# Altium schematic sheet LionIRVT-HW.SchDoc
size A4
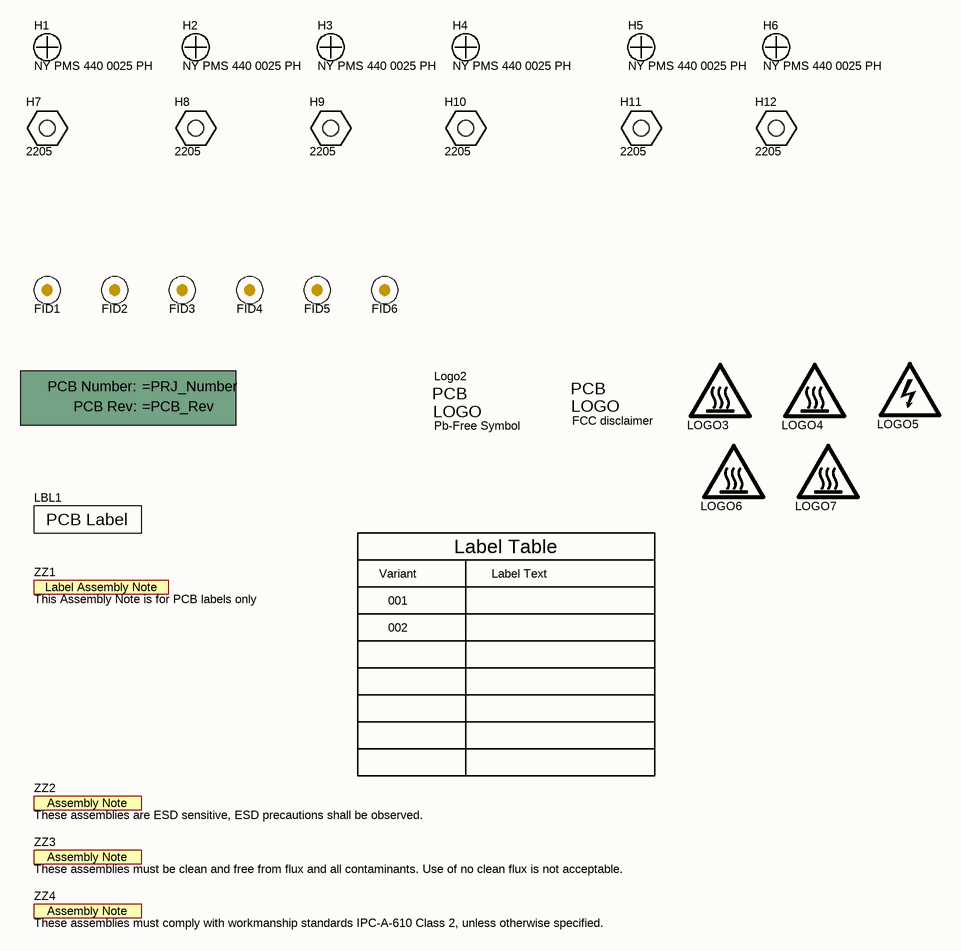
[diagram p0: LionIRVT-HW.SchDoc]

## Parts
!PCB1  Printed Circuit Board  (value not drawn)  (mechanical)
FID1  Fiducial  [Fiducial10-20]  (value not drawn)
FID2  Fiducial  [Fiducial10-20]  (value not drawn)
FID3  Fiducial  [Fiducial10-20]  (value not drawn)
FID4  Fiducial  [Fiducial10-20]  (value not drawn)
FID5  Fiducial  [Fiducial10-20]  (value not drawn)
FID6  Fiducial  [Fiducial10-20]  (value not drawn)
H1  NY PMS 440 0025 PH  [NY PMS 440 0025 PH]
H2  NY PMS 440 0025 PH  [NY PMS 440 0025 PH]
H3  NY PMS 440 0025 PH  [NY PMS 440 0025 PH]
H4  NY PMS 440 0025 PH  [NY PMS 440 0025 PH]
H5  NY PMS 440 0025 PH  [NY PMS 440 0025 PH]
H6  NY PMS 440 0025 PH  [NY PMS 440 0025 PH]
H7  2205  [KEYSTONE_2205]
H8  2205  [KEYSTONE_2205]
H9  2205  [KEYSTONE_2205]
H10  2205  [KEYSTONE_2205]
H11  2205  [KEYSTONE_2205]
H12  2205  [KEYSTONE_2205]
LBL1  (no value)  [Label_1250x250]
Logo1  FCC disclaimer  [FCC_disclaimer_stacked]  (no BOM)
Logo2  Pb-Free Symbol  [Pb-Free_Overlay_Medium]  (no BOM)
LOGO3  CAUTION HOT SURFACE  [IEC_HotSurface_Small]  (value not drawn)  (no BOM)
LOGO4  CAUTION HOT SURFACE  [IEC_HotSurface_Small]  (value not drawn)  (no BOM)
LOGO5  DANGER HIGH VOLTAGE  [IEC_HighVoltage_Small]  (value not drawn)  (no BOM)
LOGO6  CAUTION HOT SURFACE  [IEC_HotSurface_Small]  (value not drawn)  (no BOM)
LOGO7  CAUTION HOT SURFACE  [IEC_HotSurface_Small]  (value not drawn)  (no BOM)
ZZ1  This Assembly Note is for PCB labels only  [AssemblyNoteLabel]  (no BOM)
ZZ2  These assemblies are ESD sensitive, ESD precautions shall be observed.  [AssemblyNote]  (no BOM)
ZZ3  These assemblies must be clean and free from flux and all contaminants. Use of no clean flux is not acceptable.  [AssemblyNote]  (no BOM)
ZZ4  These assemblies must comply with workmanship standards IPC-A-610 Class 2, unless otherwise specified.  [AssemblyNote]  (no BOM)

## Notes on the sheet
- Label Table
- Variant
- 001
- 002
- Label Text
- (in symbol AssemblyNote) Assembly Note
- (in symbol AssemblyNoteLabel) Label Assembly Note
- (in symbol FCC_disclaimer) PCB; LOGO
- (in symbol Pb-Free) PCB; LOGO
- (in symbol PCB) PCB Number:; PCB Rev:
- (in symbol THT-13-457-10) PCB Label

## Library data of the parts
!PCB1 = PCB: Manufacturer: Any; SymbolCreator: a0412235; SymbolVersion: 2012-05-30; CompType: PCB; PartNumber: =PRJ_Number; RoHS: O; MountType: N/A; Publisher: Texas Instruments; LatestRevisionDate: 2012-06-27; LatestRevisionNote: Initial Version; Alternate Manufacturer: -; Alternate PartNumber: -
FID1-FID6 = Fiducial: Fiducial mark.  There is nothing to buy or mount.; SymbolCreator: codlsc; SymbolVersion: 2009-11-4; CompType: Fiducial; Publisher: Texas Instruments; LatestRevisionDate: 2014-08-01; LatestRevisionNote: Added Alternate PartNumber and Alternate Manufacturer parameters to appropriate components.; Manufacturer: N/A; MountType: N/A; PackageReference: Fiducial; PartNumber: N/A; ClassName: FiducialMark
H1-H6 = NY PMS 440 0025 PH: Machine Screw, Round, #4-40 x 1/4, Nylon, Philips panhead; Manufacturer: B&F Fastener Supply; CompType: Hardware; SymbolCreator: codlsc; U/M: EA; SymbolVersion: 2009-10-28; MountType: N/A; RoHS: Y; PartNumber: NY PMS 440 0025 PH; PackageReference: Screw; DigiKeyPartNumber: H542-ND; ComponentLink1Description: Datasheet Link; ComponentLink1URL: http://www.fasnetdirect.com/refguide/Machinepancombo.pdf; ClassName: Mounting Holes; Alternate Manufacturer: -; Alternate PartNumber: -; LatestRevisionDate: 2012-06-27; LatestRevisionNote: Initial Version; Publisher: Texas Instruments; Supplier 1: Digi-Key; Supplier Part Number 1: H542-ND
H7-H12 = 2205: Standoff, Hex, 1"L #4-40 Aluminum; Manufacturer: Keystone; SymbolCreator: a0412235; CompType: Standoff; MountType: N/A; RoHS: Y; PartNumber: 2205; PackageReference: 1" Aluminum Hex Standoff; ComponentLink1Description: Datasheet Link; ComponentLink1URL: http://www.keyelco.com/product-pdf.cfm?p=4279; LatestRevisionDate: 2014-11-19; Publisher: Texas Instruments; Supplier 1: Digi-Key; Supplier 2: Mouser; Supplier 3: Farnell; Supplier Part Number 1: 2205K-ND; Supplier Part Number 2: 534-2205; Supplier Part Number 3: 1785771; SymbolVersion: 2013-06-24
LBL1 = THT-13-457-10: Thermal Transfer Printable Labels, 1.250" W x 0.250" H - 10,000 per roll; Manufacturer: Brady; SymbolCreator: a0412235; CompType: Label; SymbolVersion: 2012-06-12; ClassName: Label; PartNumber: THT-13-457-10; RoHS: Y; PackageReference: PCB Label 1.25 x 0.250 inch; MountType: N/A; ComponentLink1Description: Web Page; ComponentLink1URL: http://www.bradyid.com/bradyid/pdpv/THT-13-457-10.html; Publisher: Texas Instruments; LatestRevisionDate: 2016-09-13; Supplier 1: Newark; Supplier Part Number 1: 04H3909
Logo1 = FCC_disclaimer: SymbolCreator: codlsc; SymbolVersion: 2011-08-22; Published: 2009-03-03; Publisher: Texas Instruments; LatestRevisionDate: 2014-11-20
Logo2 = Pb-Free: SymbolCreator: a0412235; SymbolVersion: 2011-08-22; Published: 2009-03-03; Publisher: Texas Instruments; LatestRevisionDate: 2016-03-21
LOGO3 LOGO4 LOGO6 LOGO7 = IEC_HotSurface: IEC 61010-1 Hot Surface Warning; SymbolCreator: a0412235; SymbolVersion: 2011-08-22; Published: 2009-03-03; Publisher: Texas Instruments; LatestRevisionDate: 2016-03-21
LOGO5 = IEC_HighVoltage: IEC 61010-1 High Voltage Warning; SymbolCreator: a0412235; SymbolVersion: 2011-08-22; Published: 2009-03-03; Publisher: Texas Instruments; LatestRevisionDate: 2016-03-21
ZZ1 = AssemblyNoteLabel: SymbolCreator: a0412235; SymbolVersion: 2012-06-14; CompType: AssemblyNote; ClassName: AssemblyNote; Publisher: Texas Instruments; LatestRevisionDate: 2012-07-31; LatestRevisionNote: Initial Version; Alternate Manufacturer: -; Alternate PartNumber: -
ZZ2-ZZ4 = AssemblyNote: SymbolCreator: codlsc; SymbolVersion: 2010-05-18; CompType: AssemblyNote; ClassName: AssemblyNote; Publisher: Texas Instruments; LatestRevisionDate: 2012-06-14; LatestRevisionNote: Initial Version; Alternate Manufacturer: -; Alternate PartNumber: -